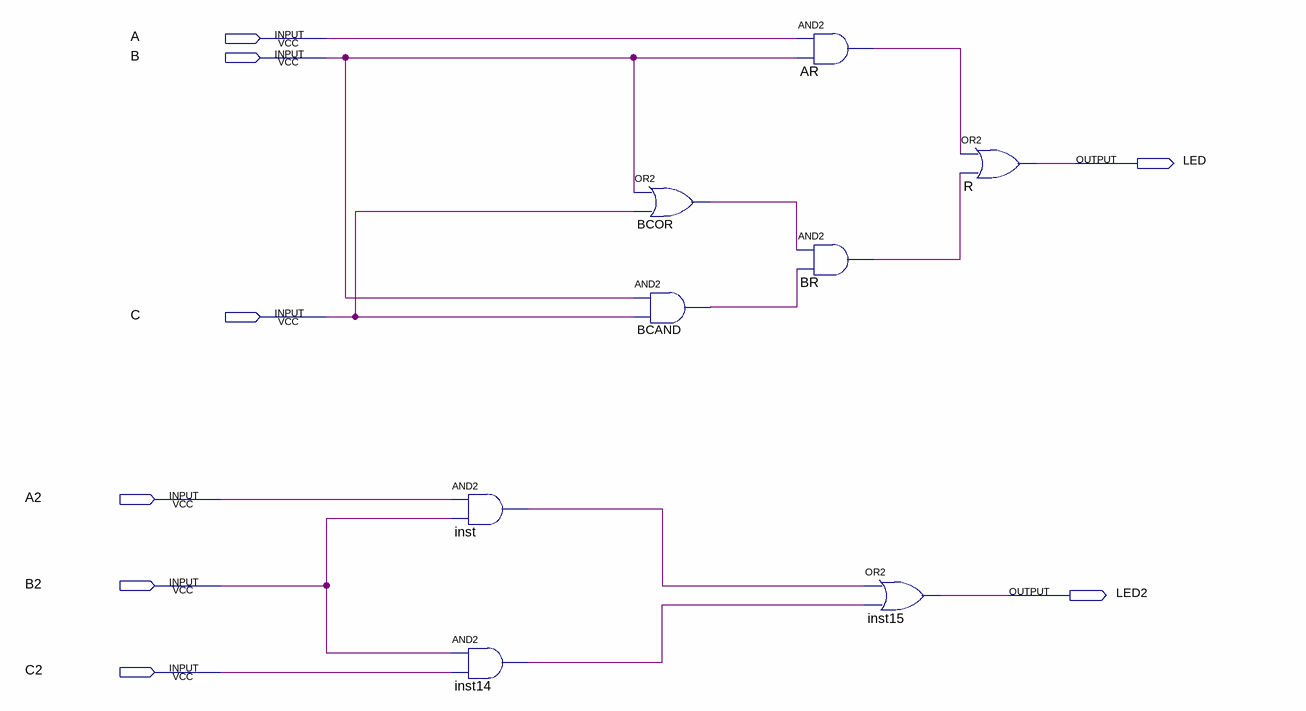
[diagram p0: schematic sheet]
// Quartus schematic Aula1.bdf as structural Verilog: 8 symbols, 8 pins
module Aula1 (
  input  A,
  input  B,
  input  C,
  input  A2,
  input  B2,
  input  C2,
  output LED,
  output LED2
);

  wire AR_out, BCAND_out, BCOR_out, BR_out, inst14_out, inst_out;

  and inst (inst_out, A2, B2);
  and inst14 (inst14_out, B2, C2);
  or BCOR (BCOR_out, B, C);
  and BCAND (BCAND_out, B, C);
  and AR (AR_out, A, B);
  and BR (BR_out, BCOR_out, BCAND_out);
  or inst15 (LED2, inst_out, inst14_out);
  or R (LED, AR_out, BR_out);
endmodule
